# EAGLE design v1 (EAGLE 6.6.0)
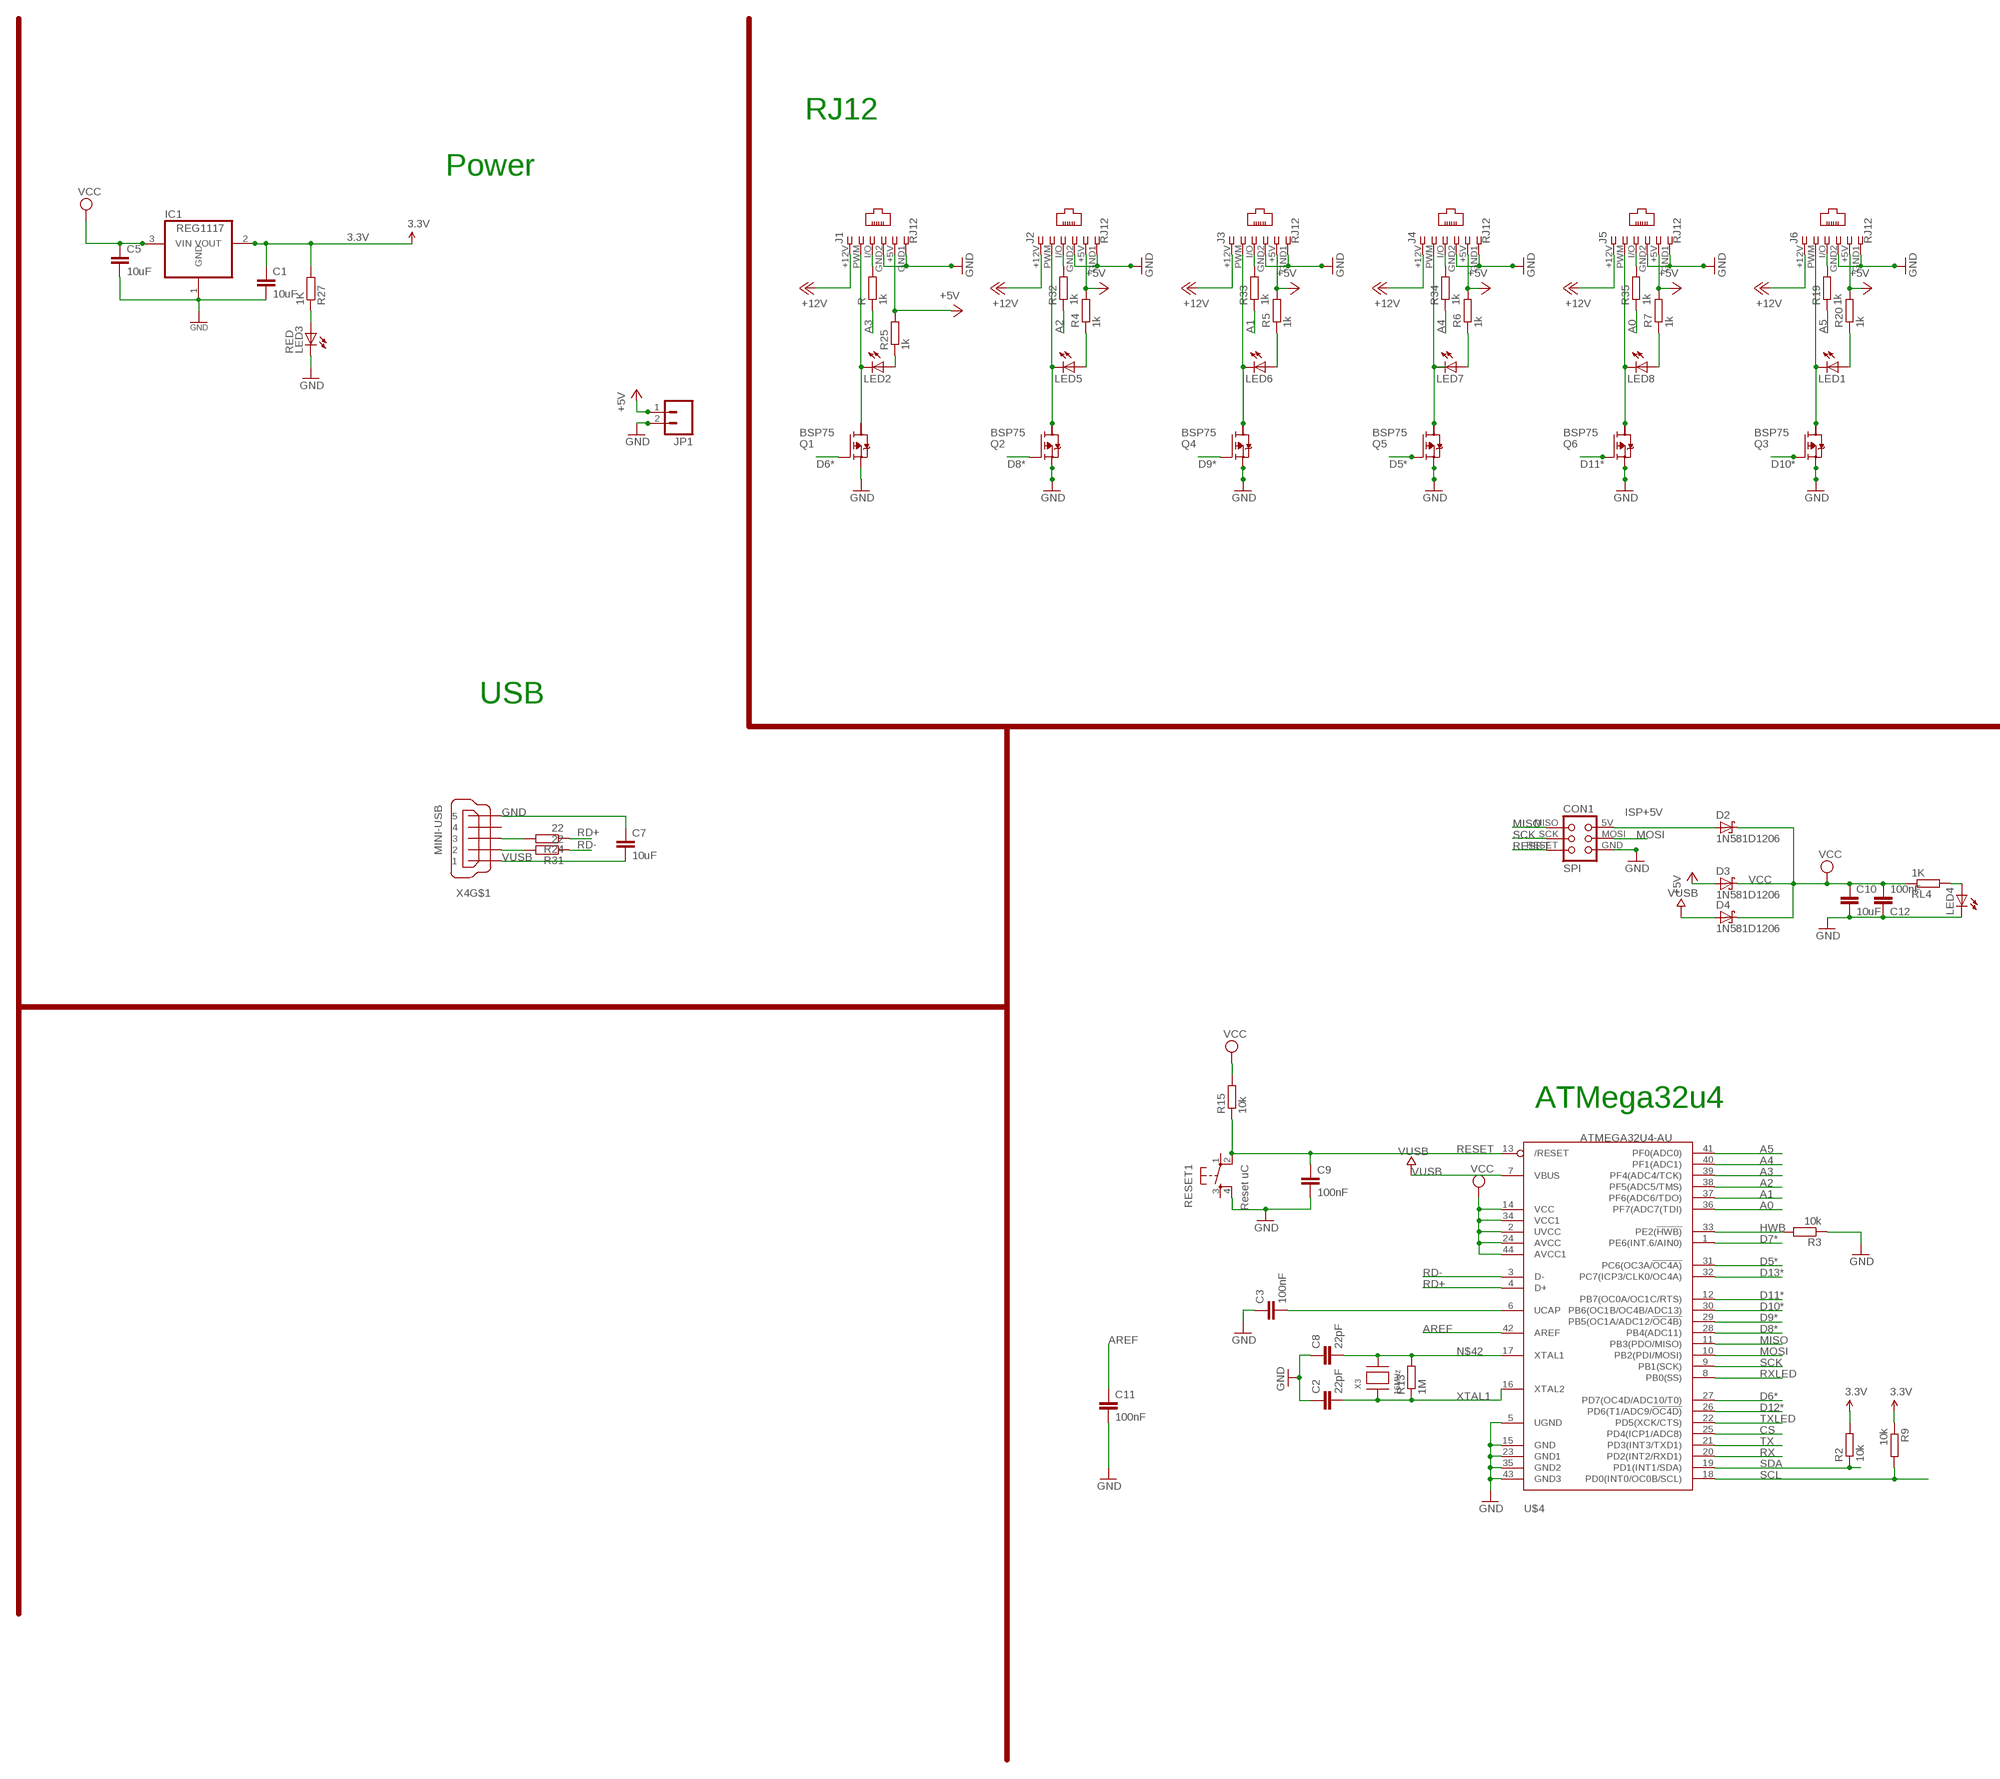
[diagram p0: schematic, sheet 1, part 1 of 2]
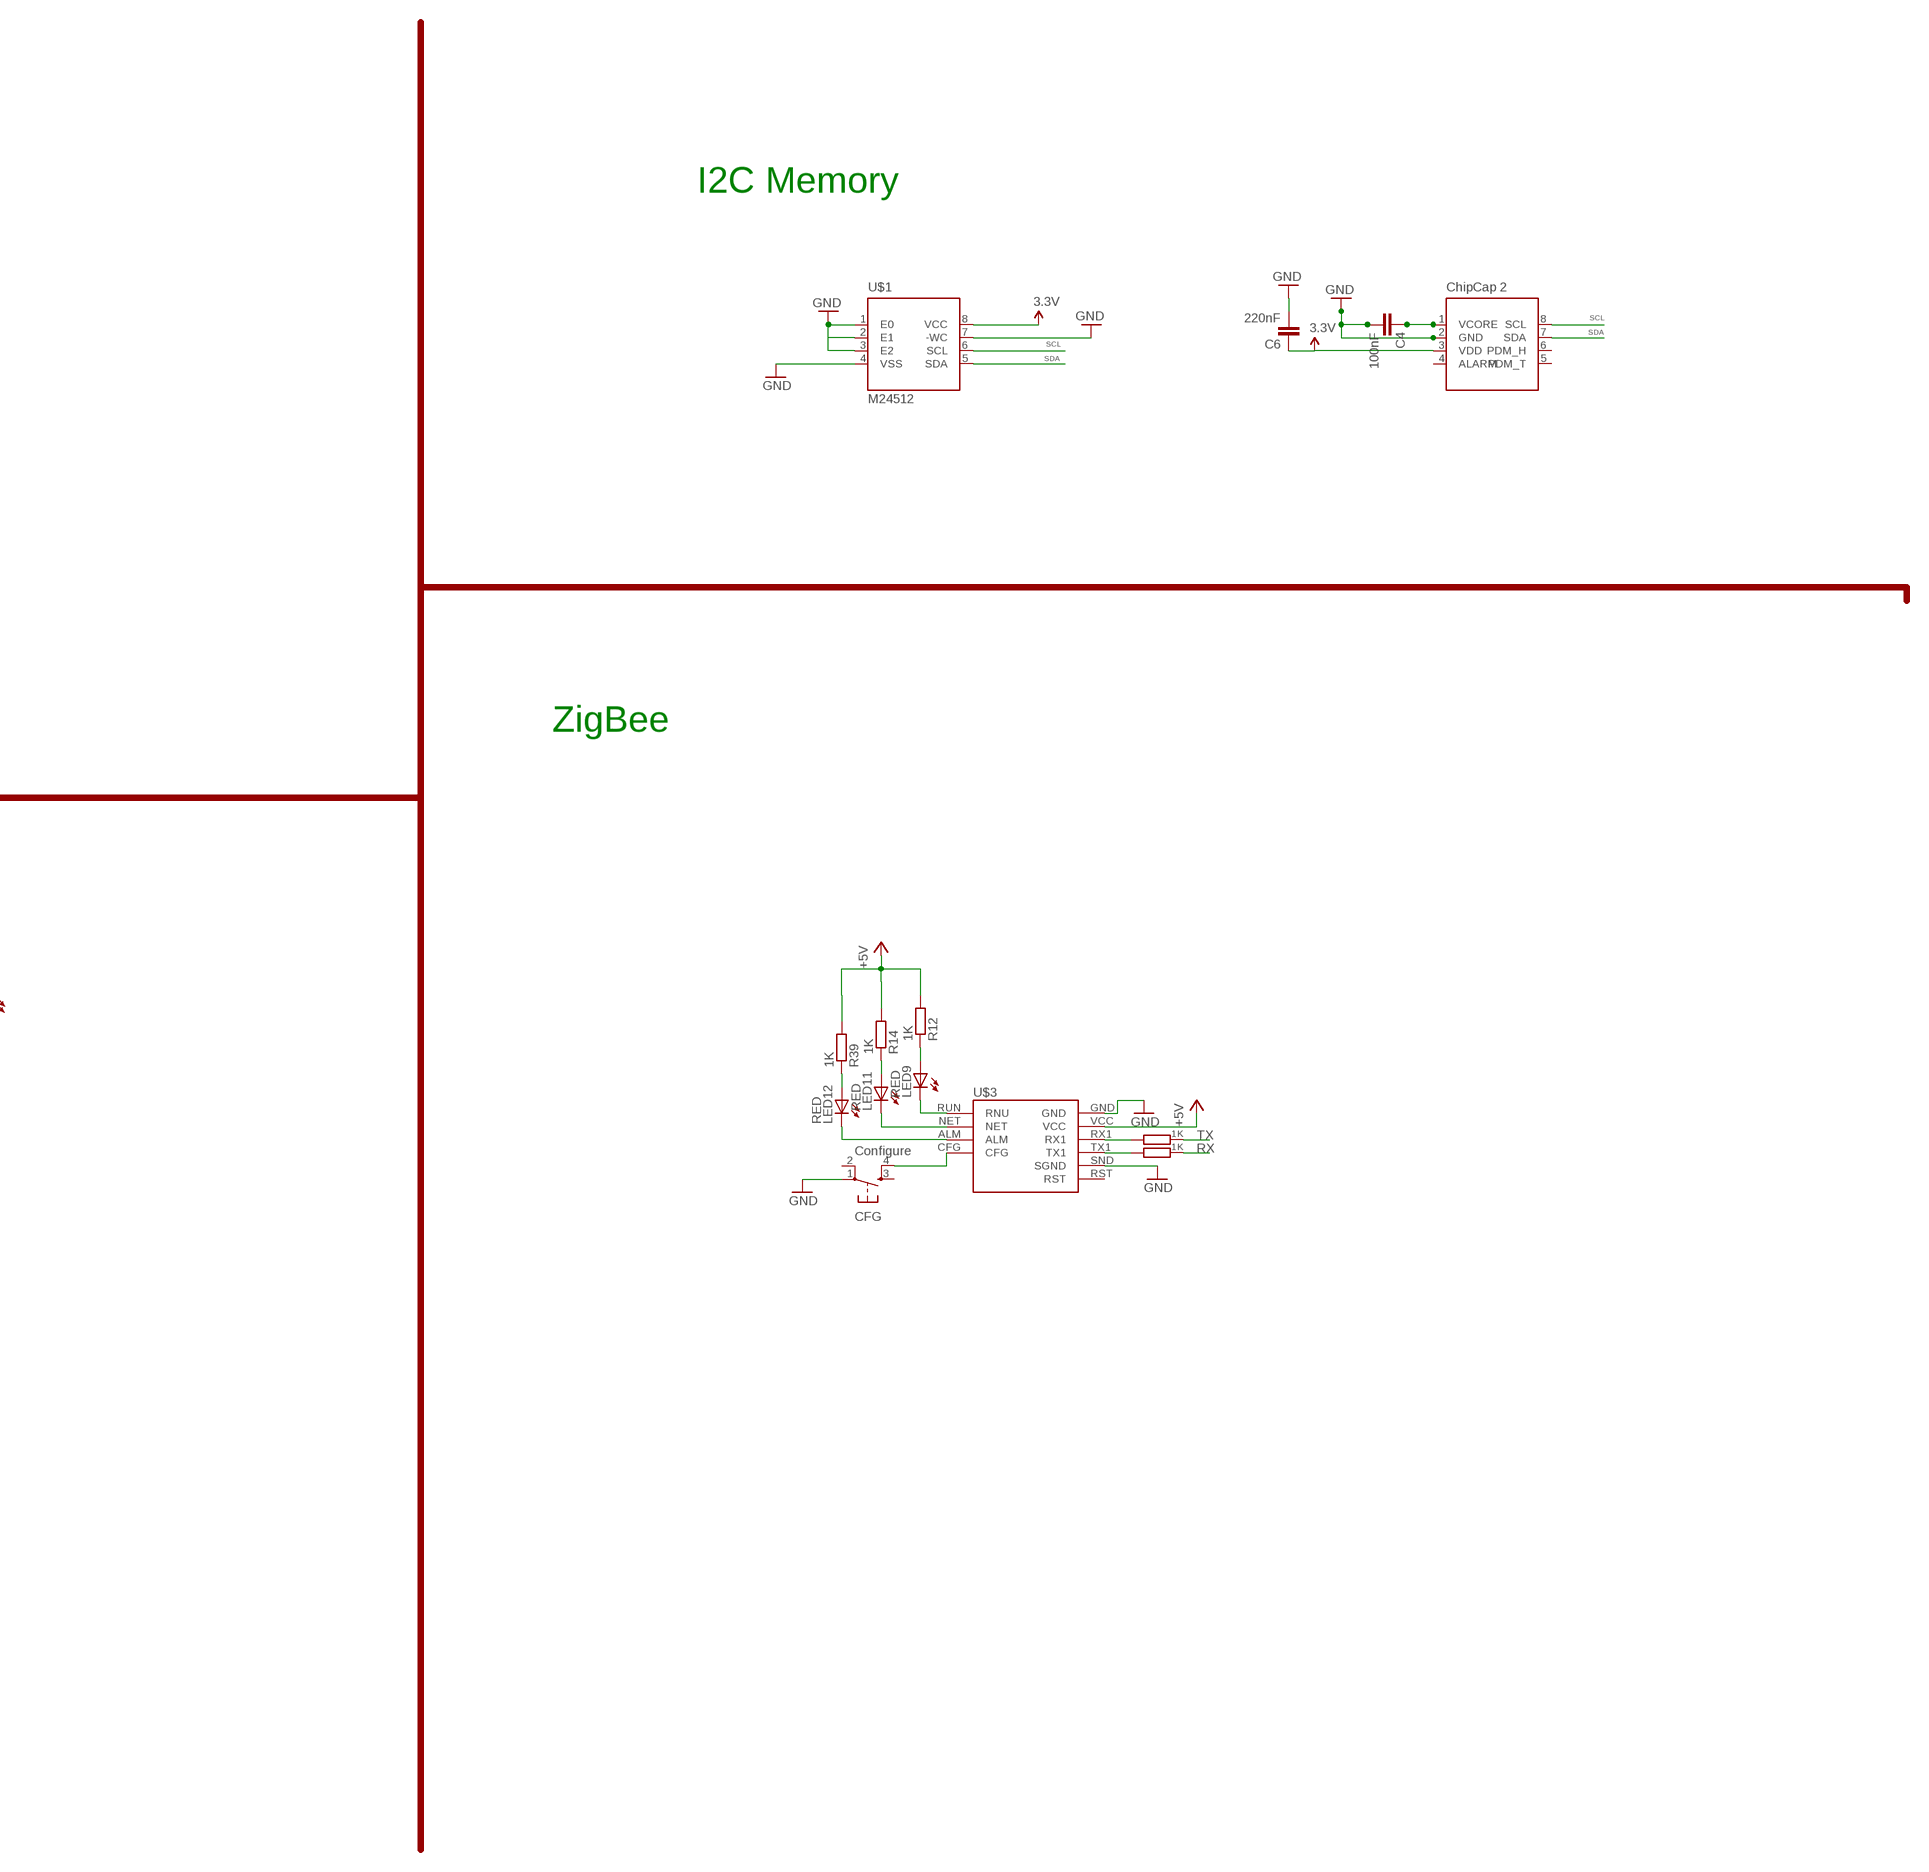
[diagram p1: schematic, sheet 1, part 2 of 2]

## Parts
C1  10uF  C-EUC1206  [C1206]
C2  22pF  C-EUC1206  [C1206]
C3  100nF  C-EUC1206  [C1206]
C4  100nF  C-EUC1206  [C1206]
C5  10uF  C-EUC1206  [C1206]
C6  220nF  C-EUC1206  [C1206]
C7  10uF  C-EUC1206  [C1206]
C8  22pF  C-EUC1206  [C1206]
C9  100nF  C-EUC1206  [C1206]
C10  10uF  C-EUC1206  [C1206]
C11  100nF  C-EUC1206  [C1206]
C12  100nF  C-EUC1206  [C1206]
CFG  Configure  TAC_SWITCHSMD  [TACTILE_SWITCH_SMD]
CON1  SPI  TINYISPT  [TC2030-MCP-NL]
D2  1N581D1206  [LED-1206]
D3  1N581D1206  [LED-1206]
D4  1N581D1206  [LED-1206]
IC1  REG1117  [SOT223]
J1  RJ12  RJ12STRAIGHT  [RJ12-STRAIGHT]
J2  RJ12  RJ12STRAIGHT  [RJ12-STRAIGHT]
J3  RJ12  RJ12STRAIGHT  [RJ12-STRAIGHT]
J4  RJ12  RJ12STRAIGHT  [RJ12-STRAIGHT]
J5  RJ12  RJ12STRAIGHT  [RJ12-STRAIGHT]
J6  RJ12  RJ12STRAIGHT  [RJ12-STRAIGHT]
JP1  M02LOCK_LONGPADS  [1X02_LOCK_LONGPADS]
LED1  Blue  LED3MM  [LED3MM]
LED2  Blue  LED3MM  [LED3MM]
LED3  RED  LEDCHIP-LED0805  [CHIP-LED0805]
LED4  RED  LED3MM  [LED3MM]
LED5  Blue  LED3MM  [LED3MM]
LED6  Blue  LED3MM  [LED3MM]
LED7  BLue  LED3MM  [LED3MM]
LED8  Blue  LED3MM  [LED3MM]
LED9  RED  LEDCHIP-LED0805  [CHIP-LED0805]
LED11  RED  LEDCHIP-LED0805  [CHIP-LED0805]
LED12  RED  LEDCHIP-LED0805  [CHIP-LED0805]
Q1  BSP75  BSP613P  [PG-SOT-223]
Q2  BSP75  BSP613P  [PG-SOT-223]
Q3  BSP75  BSP613P  [PG-SOT-223]
Q4  BSP75  BSP613P  [PG-SOT-223]
Q5  BSP75  BSP613P  [PG-SOT-223]
Q6  BSP75  BSP613P  [PG-SOT-223]
R  1k  R-EU_R0805  [R0805]
R2  10k  R-EU_M1206  [M1206]
R3  10k  R-EU_M0805  [M0805]
R4  1k  R-EU_R0805  [R0805]
R5  1k  R-EU_R0805  [R0805]
R6  1k  R-EU_R0805  [R0805]
R7  1k  R-EU_R0805  [R0805]
R8  1K  R-EU_R0805  [R0805]
R9  10k  R-EU_M1206  [M1206]
R11  1K  R-EU_R0805  [R0805]
R12  1K  R-EU_R0805  [R0805]
R13  1M  R-EU_R1206  [R1206]
R14  1K  R-EU_R0805  [R0805]
R15  10k  R-EU_M0805  [M0805]
R19  1k  R-EU_R0805  [R0805]
R20  1k  R-EU_R0805  [R0805]
R24  22  R-EU_M1206  [M1206]
R25  1k  R-EU_R0805  [R0805]
R27  1K  R-EU_R0805  [R0805]
R31  22  R-EU_M1206  [M1206]
R32  1k  R-EU_R0805  [R0805]
R33  1k  R-EU_R0805  [R0805]
R34  1k  R-EU_R0805  [R0805]
R35  1k  R-EU_R0805  [R0805]
R39  1K  R-EU_R0805  [R0805]
RESET1  Reset uC  TAC_SWITCHSMD  [TACTILE_SWITCH_SMD]
RL4  1K  R-EU_R0805  [R0805]
U$1  M24512  [SO8]
U$2  CHIPCAP  [CHIPCAP]
U$3  SZ05-ZIGBEESMD  [SZ05-ZIGBEE3]
U$4  ATMEGA32U4-AU  [TQFP44]
X3  16MHz  XTALNX6035  [NX6035]
X4  MINI-USB  MINI-USB-SCHIELD-32005-201  [32005-201]

## Nets
3.3V [power]: C1.1 C6.1 IC1.2(VOUT) R2.2 R9.1 R27.2 U$1.8(VCC) U$2.3(VDD)
+5V [power]: D3.A J1.+5V J2.+5V J3.+5V J4.+5V J5.+5V J6.+5V JP1.1 R4.2 R5.2 R6.2 R7.2 R12.2 R14.2 R20.2 R25.2 R39.2 U$3.VCC
+12V [power]: J1.+12V J2.+12V J3.+12V J4.+12V J5.+12V J6.+12V
A0: R35.1 U$4.36(PF7(ADC7(TDI))
A1: R33.1 U$4.37(PF6(ADC6/TDO))
A2: R32.1 U$4.38(PF5(ADC5/TMS))
A3: R.1 U$4.39(PF4(ADC4/TCK))
A4: R34.1 U$4.40(PF1(ADC1))
A5: R19.1 U$4.41(PF0(ADC0))
AREF: C11.1 U$4.42(AREF)
CS: U$4.25(PD4(ICP1/ADC8))
D5*: Q5.1(G) U$4.31(PC6(OC3A/!OC4A))
D6*: Q1.1(G) U$4.27(PD7(OC4D/ADC10/T0))
D7*: U$4.1(PE6(INT.6/AIN0))
D8*: Q2.1(G) U$4.28(PB4(ADC11))
D9*: Q4.1(G) U$4.29(PB5(OC1A/ADC12/!OC4B))
D10*: Q3.1(G) U$4.30(PB6(OC1B/OC4B/ADC13))
D11*: Q6.1(G) U$4.12(PB7(OC0A/OC1C/RTS))
D12*: U$4.26(PD6(T1/ADC9/!OC4D))
D13*: U$4.32(PC7(ICP3/CLK0/OC4A))
D+USB: R24.2 X4.3
D-USB: R31.2 X4.2
GND [power]: C1.2 C2.1 C3.1 C4.2 C5.2 C6.2 C7.1 C8.1 C9.2 C10.2 C11.2 C12.1 CFG.1 CON1.GND IC1.1(GND) J1.GND1 J1.GND2 J2.GND1 J2.GND2 J3.GND1 J3.GND2 J4.GND1 J4.GND2 J5.GND1 J5.GND2 J6.GND1 J6.GND2 JP1.2 LED3.C LED4.K(C) Q1.3(S) Q2.3(S) Q3.3(S) Q4.3(S) Q5.3(S) Q6.3(S) R3.1 RESET1.4 U$1.1(E0) U$1.2(E1) U$1.3(E2) U$1.4(VSS) U$1.7(-WC) U$2.2(GND) U$3.GND U$3.SND(SGND) U$4.5(UGND) U$4.15(GND) U$4.23(GND1) U$4.35(GND2) U$4.43(GND3) X4.5
GND1 [VIN]: LED9.C U$3.RUN(RNU)
GND2 [VIN]: LED11.C U$3.NET
GND3 [VIN]: LED12.C U$3.ALM
HWB: R3.2 U$4.33(PE2(!HWB))
ISP+5V: CON1.5V(VCC) D2.A
MISO: CON1.MISO U$4.11(PB3(PDO/MISO))
MOSI: CON1.MOSI U$4.10(PB2(PDI/MOSI))
N$1: J3.PWM LED6.K(C) Q4.2(D)
N$2: J2.I/O R32.2
N$3: J6.I/O R19.2
N$4: LED5.A R4.1
N$5: J4.PWM LED7.K(C) Q5.2(D)
N$6: C4.1 U$2.1(VCORE)
N$7: J3.I/O R33.2
N$9: LED1.A R20.1
N$11: R11.2 U$3.RX1
N$12: LED4.A RL4.2
N$16: C3.2 U$4.6(UCAP)
N$17: LED2.A R25.1
N$18: J1.I/O R.2
N$19: J5.PWM LED8.K(C) Q6.2(D)
N$20: LED3.A R27.1
N$21: J6.PWM LED1.K(C) Q3.2(D)
N$22: LED6.A R5.1
N$24: R8.2 U$3.TX1
N$25: LED9.A R12.1
N$26: LED11.A R14.1
N$27: LED12.A R39.1
N$28: J2.PWM LED5.K(C) Q2.2(D)
N$29: J4.I/O R34.2
N$30: LED7.A R6.1
N$32: J5.I/O R35.2
N$33: LED8.A R7.1
N$34: J1.PWM LED2.K(C) Q1.2(D)
N$35: CFG.4 U$3.CFG
N$42: C8.2 R13.2 U$4.17(XTAL1) X3.P$2
RD+: R24.1 U$4.4(D+)
RD-: R31.1 U$4.3(D-)
RESET: C9.1 CON1.RESET R15.1 RESET1.2 U$4.13(/RESET)
RX: R8.1 U$4.20(PD2(INT2/RXD1))
RXLED: U$4.8(PB0(SS))
SCK: CON1.SCK U$4.9(PB1(SCK))
SCL: R9.2 U$1.6(SCL) U$2.8(SCL) U$4.18(PD0(INT0/OC0B/SCL))
SDA: R2.1 U$1.5(SDA) U$2.7(SDA) U$4.19(PD1(INT1/SDA))
TX: R11.1 U$4.21(PD3(INT3/TXD1))
TXLED: U$4.22(PD5(XCK/CTS))
VCC [fine]: C5.1 C10.1 C12.2 D2.C D3.C D4.C IC1.3(VIN) R15.2 RL4.1 U$4.2(UVCC) U$4.14(VCC) U$4.24(AVCC) U$4.34(VCC1) U$4.44(AVCC1)
VUSB: C7.2 D4.A U$4.7(VBUS) X4.1
XTAL1: C2.2 R13.1 U$4.16(XTAL2) X3.P$1
Unconnected: CFG.2 CFG.3 Q1.4(D) Q2.4(D) Q3.4(D) Q4.4(D) Q5.4(D) Q6.4(D) RESET1.1 RESET1.3 U$2.4(ALARM) U$2.5(PDM_T) U$2.6(PDM_H) U$3.RST X4.4 X4.M1(S:S1) X4.M2(S:S2) X4.M3(S:S3) X4.M4(S:S4)

## Notes on the sheet
- RJ12
- Power
- I2C Memory
- ZigBee
- USB
- ATMega32u4

## Library data of the parts
C1-C12 = rcl:C-EU: CAPACITOR, European symbol
CFG RESET1 = lpatiny:TAC_SWITCH: Momentary Switch Button commonly used for reset or general input. Spark Fun Electronics SKU : COM-00097
CON1 = lpatiny:TINYISP: CONNECTOR
D2-D4 = lpatiny:1N581*: 1.0A SCHOTTKY BARRIER RECTIFIER Source: http://www.diodes.com/datasheets/ds23001.pdf
IC1 = burr-brown:REG1117: 800mA and 1A Low Dropout (LDO) Positive Regulator 1.8V, 2.5V, 2.85V, 3.3V, 5V, and Adj; MPN: REG1117; OC_FARNELL: 1097566; OC_NEWARK: 14P6981
J1-J6 = lpatiny:RJ12: CORCOM Modular RJ Jacks No Shield Source: www.tycoelectronics.com .. ENG_DS_1654001_1099_RJ_L_0507.pdf
JP1 = SparkFun:M02: Header 2 Standard 2-pin 0.1" header. Use with straight break away headers (SKU : PRT-00116), right angle break away headers (PRT-00553), swiss pins (PRT-00743), machine pins (PRT-00117), and female headers (PRT-00115). Molex polarized connector foot print use with SKU : PRT-08233 with associated crimp pins and housings.
LED1 LED2 LED4-LED8 = lpatiny:LED3MM
LED3 LED9 LED11 LED12 = adafruit:LED: LED OSRAM: - CHIPLED LG R971, LG N971, LY N971, LG Q971, LY Q971, LO R971, LY R971 LH N974, LH R974 LS Q976, LO Q976, LY Q976 LO Q996 - Hyper CHIPLED LW Q18S LB Q993, LB Q99A, LB R99A - SideLED LS A670, LO A670, LY A670, LG A670, LP A670 LB A673, LV A673, LT A673, LW A673 LH A674 LY A675 LS A676, LA A676, LO A676, LY A676, LW A676 LS A679, LY A679, LG A679 - Hyper Micro SIDELED® LS Y876, LA Y876, LO Y876, LY Y876 LT Y87S - SmartLED LW L88C, LW L88S LB L89C, LB L89S, LG L890 LS L89K, LO L89K, LY L89K LS L896, LA L896, LO L896, LY L896 - TOPLED LS T670, LO T670, LY T670, LG T670, LP T670 LSG T670, LSP T670, LSY T670, LOP T670, LYG T670 LG T671, LOG T671, LSG T671 LB T673, LV T673, LT T673, LW T673 LH T674 LS T676, LA T676, LO T676, LY T676, LB T676, LH T676, LSB T676, LW T676 LB T67C, LV T67C, LT T67C, LS T67K, LO T67K, LY T67K, LW E67C LS E67B, LA E67B, LO E67B, LY E67B, LB E67C, LV E67C, LT E67C LW T67C LS T679, LY T679, LG T679 LS T770, LO T770, LY T770, LG T770, LP T770 LB T773, LV T773, LT T773, LW T773 LH T774 LS E675, LA E675, LY E675, LS T675 LS T776, LA T776, LO T776, LY T776, LB T776 LHGB T686 LT T68C, LB T68C - Hyper Mini TOPLED® LB M676 - Mini TOPLED Santana® LG M470 LS M47K, LO M47K, LY M47K Source: http://www.osram.convergy.de/
Q1-Q6 = infineon:BSP613P: SIPMOS (R) Small-Signal-Transistor P-Channel (2 Drain) Source: http://www.infineon.com/dgdl/BSP613P_Rev2.4.pdf; OC_FARNELL: unknown; OC_NEWARK: unknown
R R4-R8 R11-R14 R19 R20 R25 R27 R32-R35 R39 = rcl:R-EU_: RESISTOR, European symbol
R2 R3 R9 R15 R24 R31 RL4 = resistor:R-EU_: RESISTOR, European symbol
U$1 = lpatiny:M24512
U$2 = lpatiny:CHIPCAP
U$3 = lpatiny:SZ05-ZIGBEE
U$4 = adafruit:ATMEGA32U4: http://www.ladyada.net/library/eagle
X3 = lpatiny:XTAL: Low cost SMT crystals, no capacitors included http://www.ladyada.net/library/eagle
X4 = con-cypressindustries:MINI-USB-SCHIELD-: MINI USB-B Conector Source: www.cypressindustries.com; OC_FARNELL: unknown; OC_NEWARK: unknown

## Net classes
0 default: width 0.305 mm
1 power: width 0.457 mm
2 VIN: width 0.457 mm
3 fine: width 0.305 mm
4 aref: width 0.305 mm

## Board
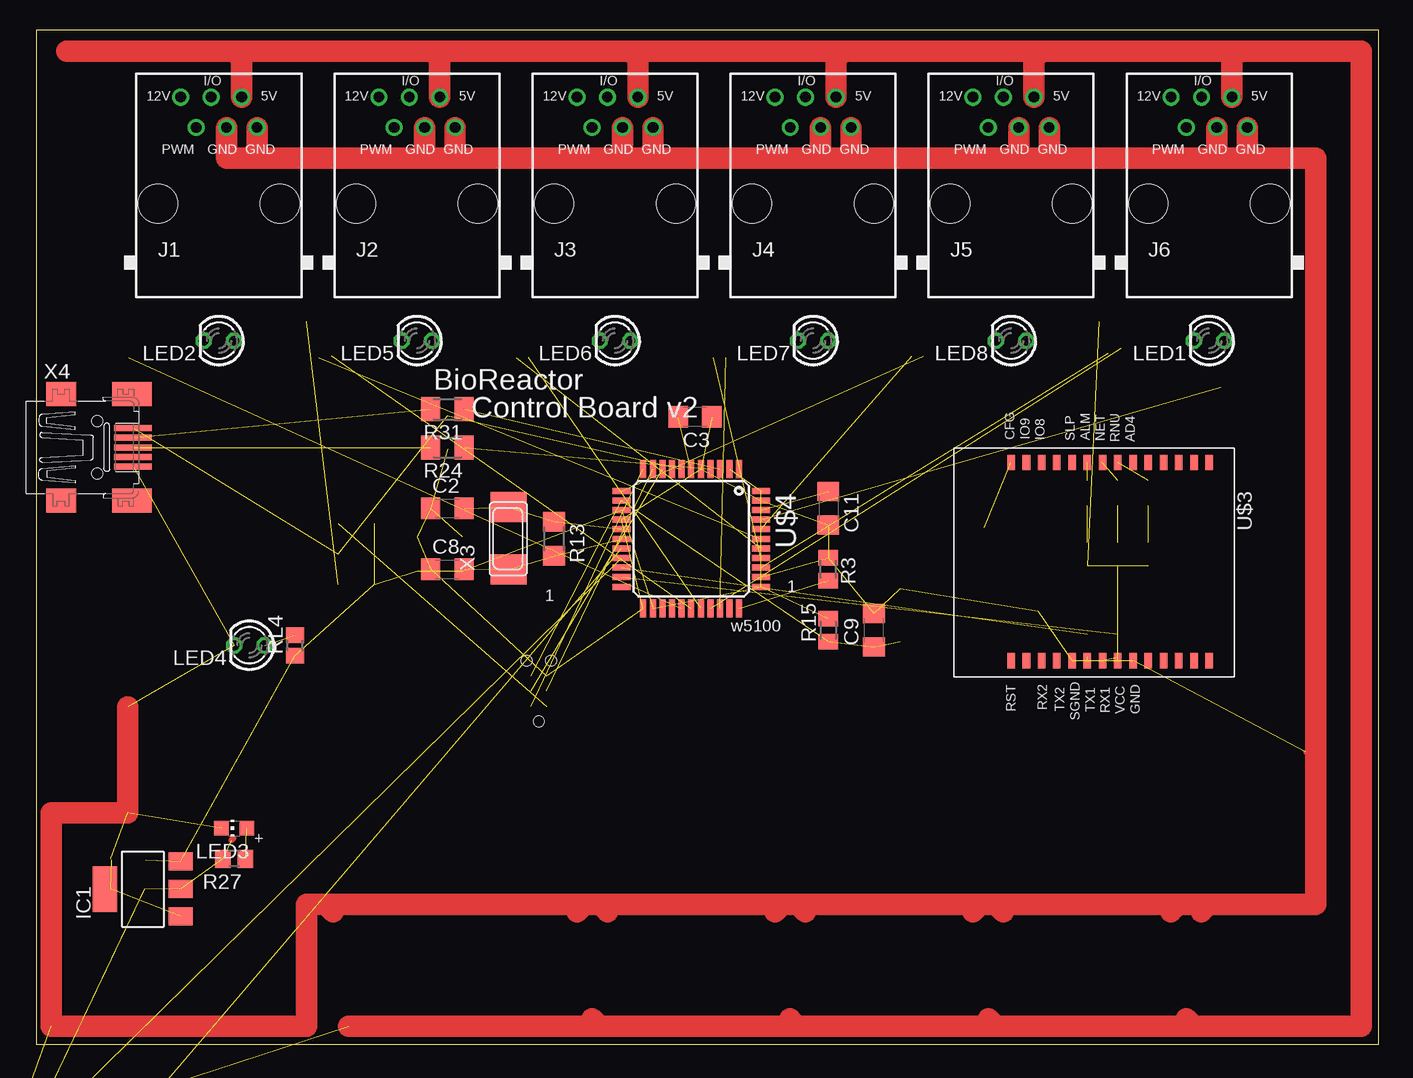
[diagram p2: board, top side]
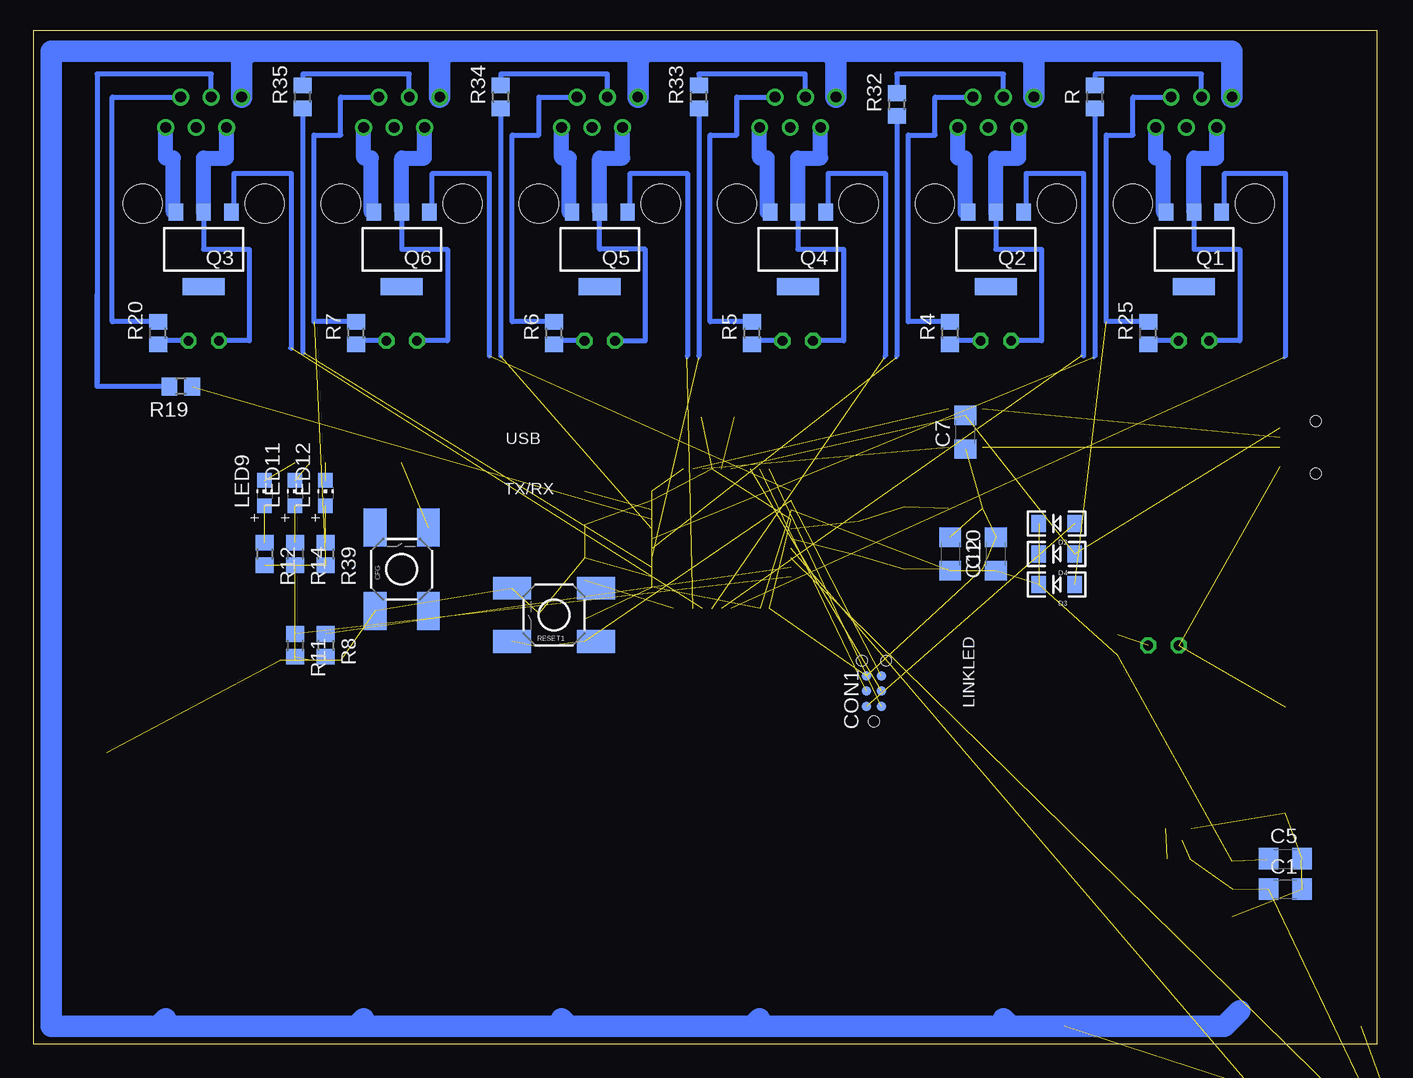
[diagram p3: board, bottom side, seen from below]

Size 111.94 x 84.57 mm. Coordinates in mm from the lower left corner, seen from the top.
Outline: 0,0 111.94,0 111.94,84.57 0,84.57 0,0
Copper layers (1*16): Top 0.035mm / dielectric 1.5mm / Bottom 0.035mm
Design rules "Fusion_eagle_rule_v1.1": minimum track width 6mil, minimum drill 12mil, track to track 6mil, track to pad 6mil, pad to pad 6mil, via to via 6mil, smd to smd 0mil, copper to edge 10mil, drill to drill 10mil, minimum pad ring 10mil, minimum via ring 6mil, stop-mask expansion 2mil, vias tented up to drill 100mil, thermal gap 10mil
bKeepout: area -1.3,57.4 to 114.3,85.3; area -7.6,54.9 to 108,82.8
tRestrict: area -6.3,58.7 to 116.8,85.3; area 22.9,-4.8 to 118.1,16.8
bRestrict: area -6.3,58.7 to 116.8,85.3; area 22.9,-4.8 to 118.1,16.8
vRestrict: area 47,34.5 to 62.2,38.4; area 47,35.8 to 50.8,49.8; area 58.4,37.1 to 62.2,49.8; area 47,46 to 62.2,49.8; area 47,25.7 to 62.2,29.5

### Footprints (pad centres in the part's own frame; a part is rotated, then mirrored left to right if it is on the bottom)
C1206 = smd 1.6 x 1.8: 1 -1.4,0; 2 1.4,0
TACTILE_SWITCH_SMD = smd 3.175 x 1.905: 1 -3.493,2.223; 2 3.493,2.223; 3 -3.493,-2.223; 4 3.493,-2.223
TC2030-MCP-NL = smd 0.787 x 0.787: 5V 1.27,0.635; GND 3.81,0.635; MISO 1.27,-0.635; MOSI 2.54,0.635; RESET 3.81,-0.635; SCK 2.54,-0.635 | hole 0.889: 0,0; 5.08,-1.016; 5.08,1.016
LED-1206 = smd 1.2 x 1.4: A -1.5,0; C 1.5,0
SOT223 = smd 1.499 x 2.007: 1 -2.261,-3.15; 2 0.025,-3.15; 3 2.311,-3.15 | smd 3.81 x 2.007: 4 0,3.15
RJ12-STRAIGHT = drill 0.9 pad 1.4: +5V 1.905,8.89; +12V -3.175,8.89; GND1 3.175,6.35; GND2 0.635,6.35; I/O -0.635,8.89; PWM -1.905,6.35 | hole 3.251: -5.08,0; 5.08,0
1X02_LOCK_LONGPADS = drill 1.016 long: 1 -0.127,0; 2 2.667,0
LED3MM = drill 0.813 octagon: A -1.27,0; K 1.27,0
CHIP-LED0805 = smd 1.2 x 1.2: A 0,-1.05; C 0,1.05
PG-SOT-223 = smd 1.2 x 1.4: 1 -2.311,-3.099; 2 0,-3.099; 3 2.311,-3.099 | smd 3.5 x 1.4: 4 0,3.099
R0805 = smd 1.3 x 1.5: 1 -0.95,0; 2 0.95,0
M1206 = smd 1.6 x 2: 1 -1.4,0; 2 1.4,0
M0805 = smd 1.3 x 1.6: 1 -0.95,0; 2 0.95,0
R1206 = smd 1.6 x 1.803: 1 -1.422,0; 2 1.422,0
R0805' = smd 1.3 x 1.5: 1 -0.85,0; 2 0.85,0
SO8 = smd 0.66 x 2.032: 1 -3.81,-3.073; 2 -2.54,-3.073; 3 -1.27,-3.073; 4 0,-3.073; 5 0,3.073; 6 -1.27,3.073; 7 -2.54,3.073; 8 -3.81,3.073
CHIPCAP = smd 0.66 x 2.032: 1 -2.54,-3.073; 2 -1.27,-3.073; 3 0,-3.073; 4 1.27,-3.073; 5 1.27,2.438; 6 0,2.438; 7 -1.27,2.438; 8 -2.54,2.438
SZ05-ZIGBEE3 = smd 1.27 x 0.635: AD1 -7.62,6.35; AD2 -7.62,5.08; AD3 -7.62,3.81; AD4 -7.62,2.54; ALM -7.62,-1.27; C485 -7.62,-3.81; CFG -7.62,-7.62; GND 8.89,2.54; IO1 -7.62,8.89; IO2 -7.62,7.62; IO3 8.89,8.89; IO4 8.89,7.62; IO5 8.89,6.35; IO6 8.89,5.08; IO7 8.89,3.81; IO8 -7.62,-5.08; IO9 -7.62,-6.35; MS 8.89,-6.35; NET -7.62,0; RST 8.89,-7.62; RUN -7.62,1.27; RX1 8.89,0; RX2 8.89,-5.08; SLD -7.62,-2.54; SND 8.89,-2.54; TX1 8.89,-1.27; TX2 8.89,-3.81; VCC 8.89,1.27
TQFP44 = smd 1.5 x 0.5: 1 -5.8,4; 2 -5.8,3.2; 3 -5.8,2.4; 4 -5.8,1.6; 5 -5.8,0.8; 6 -5.8,0; 7 -5.8,-0.8; 8 -5.8,-1.6; 9 -5.8,-2.4; 10 -5.8,-3.2; 11 -5.8,-4; 23 5.8,-4; 24 5.8,-3.2; 25 5.8,-2.4; 26 5.8,-1.6; 27 5.8,-0.8; 28 5.8,0; 29 5.8,0.8; 30 5.8,1.6; 31 5.8,2.4; 32 5.8,3.2; 33 5.8,4 | smd 0.5 x 1.5: 12 -4,-5.8; 13 -3.2,-5.8; 14 -2.4,-5.8; 15 -1.6,-5.8; 16 -0.8,-5.8; 17 0,-5.8; 18 0.8,-5.8; 19 1.6,-5.8; 20 2.4,-5.8; 21 3.2,-5.8; 22 4,-5.8; 34 4,5.8; 35 3.2,5.8; 36 2.4,5.8; 37 1.6,5.8; 38 0.8,5.8; 39 0,5.8; 40 -0.8,5.8; 41 -1.6,5.8; 42 -2.4,5.8; 43 -3.2,5.8; 44 -4,5.8
NX6035 = smd 2.5 x 3: P$1 2.665,0; P$2 -2.565,0
32005-201 = smd 3.1 x 0.5: 1 3,1.6; 2 3,0.8; 3 3,0; 4 3,-0.8; 5 3,-1.6 | smd 2.5 x 2: M1 -3,-4.45; M2 -3,4.45 | smd 3.3 x 2: M3 2.9,4.45; M4 2.9,-4.45 | hole 0.9: 0,2.2; 0,-2.2

### Placement (x,y rotation side)
C1  7.62,12.95 0 bottom
C2  34.29,44.7 0 top
C3  54.93,52.32 180 top
C4  -10.16,-35.31 0 top  (outside the outline)
C5  7.62,15.49 0 bottom
C6  -10.16,-41.66 0 top  (outside the outline)
C7  34.29,51.05 90 bottom
C8  34.29,39.62 0 top
C9  69.85,34.54 90 top
C10  31.75,40.89 90 bottom
C11  66.04,44.7 270 top
C12  35.56,40.89 270 bottom
CFG  81.28,39.62 90 bottom
CON1  41.91,26.92 90 bottom
D2  26.67,43.43 180 bottom
D3  26.67,38.35 180 bottom
D4  26.67,40.89 180 bottom
IC1  8.89,12.95 90 top
J1  15.24,70.1 0 top
J2  31.75,70.1 0 top
J3  48.26,70.1 0 top
J4  64.77,70.1 0 top
J5  81.28,70.1 0 top
J6  97.79,70.1 0 top
JP1  -5.08,-8.64 0 top  (outside the outline)
LED1  97.79,58.67 180 top
LED2  15.24,58.67 180 top
LED3  16.51,18.03 90 top
LED4  17.78,33.27 180 top
LED5  31.75,58.67 180 top
LED6  48.26,58.67 180 top
LED7  64.77,58.67 180 top
LED8  81.28,58.67 180 top
LED9  92.71,45.97 0 bottom
LED11  90.17,45.97 0 bottom
LED12  87.63,45.97 0 bottom
Q1  15.24,66.29 180 bottom
Q2  31.75,66.29 180 bottom
Q3  97.79,66.29 180 bottom
Q4  48.26,66.29 180 bottom
Q5  64.77,66.29 180 bottom
Q6  81.28,66.29 180 bottom
R  23.5,78.99 90 bottom
R2  -5.08,-13.72 0 top  (outside the outline)
R3  66.04,39.62 270 top
R4  35.56,59.31 90 bottom
R5  52.07,59.31 90 bottom
R6  68.58,59.31 90 bottom
R7  85.09,59.31 90 bottom
R8  87.63,33.27 270 bottom
R9  -5.08,-20.07 0 top  (outside the outline)
R11  90.17,33.27 270 bottom
R12  92.71,40.89 270 bottom
R13  43.18,42.16 270 top
R14  90.17,40.89 270 bottom
R15  66.04,34.54 90 top
R19  99.69,54.86 180 bottom
R20  101.6,59.31 90 bottom
R24  34.29,49.78 180 top
R25  19.05,59.31 90 bottom
R27  16.51,15.49 180 top
R31  34.29,52.96 180 top
R32  40.01,78.36 90 bottom
R33  56.52,78.99 90 bottom
R34  73.03,78.99 90 bottom
R35  89.53,78.99 90 bottom
R39  87.63,40.89 270 bottom
RESET1  68.58,35.81 180 bottom
RL4  1K  [R0805']  21.59,33.27 90 top
U$1  0,-27.69 0 top  (outside the outline)
U$2  -10.16,-27.69 0 top  (outside the outline)
U$3  88.9,40.89 270 top
U$4  54.61,42.16 270 top
X3  39.37,42.16 90 top
X4  5.08,49.78 0 top

### Tracks (layer width: path | path; a pad name or v marks a point on that pad's centre or on a via)
3.3V  (8 unrouted)
  Top 0.457: 16.46,17.22 16.26,17.02
+5V  (6 unrouted)
  Top 1.778: 2.54,82.8 16.51,82.8 | 16.51,82.8 33.02,82.8 | 33.02,82.8 49.53,82.8 | 49.53,82.8 67.31,82.8 | 67.31,82.8 83.82,82.8 | 83.82,82.8 100.33,82.8 | 100.33,82.8 110.49,82.8 110.49,1.52 96.52,1.52 | 96.52,1.52 80.01,1.52 | 80.01,1.52 63.5,1.52 | 63.5,1.52 46.99,1.52 | 46.99,1.52 26.04,1.52 | J1.+5V 17.14,82.17 16.51,82.8 | J2.+5V 33.66,82.17 33.02,82.8 | J3.+5V 50.16,82.17 49.53,82.8 | J4.+5V 66.67,82.17 67.31,82.8 | J5.+5V 83.19,82.17 83.82,82.8 | J6.+5V 99.69,82.17 100.33,82.8 | 46.35,2.16 46.99,1.52 | 62.87,2.16 63.5,1.52 | 79.38,2.16 80.01,1.52 | 95.89,2.16 96.52,1.52
  Bottom 0.406: R25.2 22.54,60.26 22.54,75.82 20.32,75.82 20.32,78.99 J1.+5V | R4.2 39.05,60.26 39.05,75.82 36.83,75.82 36.83,78.99 J2.+5V | R5.2 55.56,60.26 55.56,75.82 53.34,75.82 53.34,78.99 J3.+5V | R6.2 72.07,60.26 72.07,75.82 69.85,75.82 69.85,78.99 J4.+5V | R7.2 88.58,60.26 88.58,75.82 86.36,75.82 86.36,78.99 J5.+5V | R20.2 105.41,60.26 105.41,78.99 J6.+5V
+12V
  Bottom 1.778: 11.43,2.79 12.7,1.52 30.48,1.52 | 30.48,1.52 52.07,1.52 | 52.07,1.52 67.31,1.52 | 67.31,1.52 85.09,1.52 | 85.09,1.52 101.6,1.52 | 101.6,1.52 110.49,1.52 110.49,82.8 93.98,82.8 | 93.98,82.8 77.47,82.8 | 77.47,82.8 60.96,82.8 | 60.96,82.8 45.72,82.8 | 45.72,82.8 29.21,82.8 | 29.21,82.8 12.06,82.8 J1.+12V | J3.+12V 45.09,82.17 45.72,82.8 | J4.+12V 61.59,82.17 60.96,82.8 | J5.+12V 78.11,82.17 77.47,82.8 | J6.+12V 94.61,82.17 93.98,82.8 | J2.+12V 28.57,82.17 29.21,82.8 | 100.97,2.16 101.6,1.52 | 84.45,2.16 85.09,1.52 | 67.94,2.16 67.31,1.52 | 51.44,2.16 52.07,1.52 | 31.11,2.16 30.48,1.52
A0  (1 unrouted)
  Bottom 0.305: 89.41,57.66 89.53,57.72
  Bottom 0.406: R35.1 89.53,57.72
A1  (1 unrouted)
  Bottom 0.305: 56.49,57.25 56.52,57.4
  Bottom 0.406: R33.1 56.52,57.4
A2  (1 unrouted)
  Bottom 0.305: 40.03,57.25 40.01,57.4
  Bottom 0.406: R32.1 40.01,57.4
A3  (1 unrouted)
  Bottom 0.305: 23.57,57.25 23.5,57.4
  Bottom 0.406: R.1 23.5,57.4
A4  (1 unrouted)
  Bottom 0.305: 72.95,57.45 73.03,57.45
  Bottom 0.406: R34.1 73.03,57.45 73.03,57.4
A5  (1 unrouted)
  Bottom 0.305: 98.96,54.81 98.75,54.81 R19.1
AREF  (1 unrouted)
D5*  (1 unrouted)
  Bottom 0.305: 57.51,57.25 57.47,57.4
  Bottom 0.406: Q5.1 62.23,69.39 62.23,72.64 57.47,72.64 57.47,57.4
D6*  (1 unrouted)
  Bottom 0.305: 7.72,57.25 7.62,57.4
  Bottom 0.406: Q1.1 12.7,69.39 12.7,72.64 7.62,72.64 7.62,57.4
D8*  (1 unrouted)
  Bottom 0.305: 24.59,57.45 24.45,57.45
  Bottom 0.406: Q2.1 29.21,69.39 29.21,72.64 24.45,72.64 24.45,57.45 24.45,57.4
D9*  (1 unrouted)
  Bottom 0.305: 41.05,57.25 40.96,57.4
  Bottom 0.406: Q4.1 45.72,69.39 45.72,72.64 40.96,72.64 40.96,57.4
D10*  (1 unrouted)
  Bottom 0.305: 90.63,58.06 90.49,58.06
  Bottom 0.406: Q3.1 95.25,69.39 95.25,72.64 90.49,72.64 90.49,58.06 90.49,58.04
D11*  (1 unrouted)
  Bottom 0.305: 73.97,58.06 73.98,58.06
  Bottom 0.406: Q6.1 78.74,69.39 78.74,72.64 73.98,72.64 73.98,58.06 73.98,57.4
D+USB  (1 unrouted)
D-USB  (1 unrouted)
GND  (34 unrouted)
  Top 0.457: 15.85,18.24 15.65,18.03 LED3.C | 105.87,24.33 106.68,24.33
  Top 1.778: 24.13,11.68 22.54,11.68 22.54,1.52 1.27,1.52 1.27,19.3 7.62,19.3 7.62,28.15 | 24.13,11.68 45.72,11.68 | 45.72,11.68 46.99,11.68 | 46.99,11.68 62.23,11.68 | 62.23,11.68 63.5,11.68 | 63.5,11.68 78.74,11.68 | 78.74,11.68 80.01,11.68 | 80.01,11.68 95.25,11.68 | 95.25,11.68 97.79,11.68 | 97.79,11.68 106.68,11.68 106.68,24.33 106.68,73.91 100.33,73.91 | 100.33,73.91 99.06,73.91 | 99.06,73.91 85.09,73.91 | 85.09,73.91 81.28,73.91 | 81.28,73.91 68.58,73.91 | 68.58,73.91 64.77,73.91 | 64.77,73.91 50.8,73.91 | 50.8,73.91 48.26,73.91 | 48.26,73.91 35.56,73.91 | 35.56,73.91 31.75,73.91 | 31.75,73.91 17.78,73.91 | 17.78,73.91 15.88,73.91 J1.GND2 | J1.GND1 18.41,74.55 17.78,73.91 | J2.GND2 32.38,74.55 31.75,73.91 | J2.GND1 34.92,74.55 35.56,73.91 | J3.GND2 48.9,74.55 48.26,73.91 | J3.GND1 51.44,74.55 50.8,73.91 | J4.GND2 65.41,74.55 64.77,73.91 | J4.GND1 67.94,74.55 68.58,73.91 | J5.GND2 81.92,74.55 81.28,73.91 | J5.GND1 84.45,74.55 85.09,73.91 | J6.GND2 98.42,74.55 99.06,73.91 | J6.GND1 100.97,74.55 100.33,73.91 | 24.77,11.05 24.13,11.68 | 45.09,11.05 45.72,11.68 | 47.62,11.05 46.99,11.68 | 61.59,11.05 62.23,11.68 | 64.14,11.05 63.5,11.68 | 78.11,11.05 78.74,11.68 | 80.64,11.05 80.01,11.68 | 94.61,11.05 95.25,11.68 | 97.16,11.05 97.79,11.68
  Bottom 0.457: 6.3,12.95 C1.2 | 6.3,15.39 C5.2 6.5,15.39
  Bottom 1.27: Q2.3 34.29,69.39 34.29,73.91 34.92,73.91 J2.GND1 | Q4.3 50.8,69.39 50.8,73.91 51.44,73.91 J3.GND1 | Q5.3 67.31,69.39 67.31,73.91 67.94,73.91 J4.GND1 | Q6.3 83.82,69.39 83.82,73.91 84.45,73.91 J5.GND1 | Q3.3 100.33,69.39 100.33,73.91 100.97,73.91 J6.GND1 | Q1.3 17.78,69.39 17.78,73.91 18.41,73.91 J1.GND1
GND1  (1 unrouted)
GND2  (1 unrouted)
GND3  (1 unrouted)
HWB  (1 unrouted)
ISP+5V  (1 unrouted)
MISO  (1 unrouted)
MOSI  (1 unrouted)
N$1
  Bottom 0.406: Q4.2 48.26,66.29 44.45,66.29 44.45,58.67 LED6.K
  Bottom 1.27: Q4.2 48.26,73.91 46.35,73.91 J3.PWM
N$2
  Bottom 0.406: J2.I/O 31.11,80.9 40.01,80.9 R32.2
N$3
  Bottom 0.406: J6.I/O 97.16,80.9 106.68,80.9 106.68,62.48 | 106.68,62.48 106.68,56.13 | 106.68,56.13 106.68,55.18 | 106.68,55.18 106.68,56.13 | 106.68,56.13 106.68,62.48 | 106.68,55.18 106.68,56.13 | 106.68,56.13 106.68,62.48 | R19.2 106.68,54.86 106.68,56.13
N$4
  Bottom 0.406: LED5.A 35.56,58.67 R4.1
N$5
  Bottom 0.406: LED7.K 60.96,58.67 60.96,66.29 64.77,66.29 Q5.2
  Bottom 1.27: Q5.2 64.77,73.91 62.87,73.91 J4.PWM
N$6  (1 unrouted)
N$7
  Bottom 0.406: J3.I/O 47.62,80.9 56.52,80.9 R33.2
N$9
  Bottom 0.406: LED1.A 101.6,58.67 R20.1
N$11  (1 unrouted)
N$12  (1 unrouted)
N$16  (1 unrouted)
N$17
  Bottom 0.406: LED2.A 19.05,58.67 R25.1
N$18
  Bottom 0.406: J1.I/O 14.61,80.9 23.5,80.9 R.2
N$19
  Bottom 0.406: Q6.2 81.28,66.29 77.47,66.29 77.47,58.67 LED8.K
  Bottom 1.27: Q6.2 81.28,73.91 79.38,73.91 J5.PWM
N$20  (1 unrouted)
  Top 0.305: 17.48,18.03 LED3.A
N$21
  Bottom 0.406: Q3.2 97.79,66.29 93.98,66.29 93.98,58.67 LED1.K
  Bottom 1.27: Q3.2 97.79,73.91 95.89,73.91 J6.PWM
N$22
  Bottom 0.406: LED6.A 52.07,58.67 R5.1
N$24  (1 unrouted)
N$25  (1 unrouted)
N$26  (1 unrouted)
N$27  (1 unrouted)
N$28
  Bottom 0.406: Q2.2 31.75,66.29 27.94,66.29 27.94,58.67 LED5.K
  Bottom 1.27: Q2.2 31.75,73.91 29.84,73.91 J2.PWM
N$29
  Bottom 0.406: J4.I/O 64.14,80.9 73.03,80.9 R34.2
N$30
  Bottom 0.406: LED7.A 68.58,58.67 R6.1
N$32
  Bottom 0.406: J5.I/O 80.64,80.9 89.53,80.9 R35.2
N$33
  Bottom 0.406: LED8.A 85.09,58.67 R7.1
N$34
  Bottom 0.406: Q1.2 15.24,66.29 11.43,66.29 11.43,58.67 LED2.K
  Bottom 1.27: Q1.2 15.24,73.91 13.34,73.91 J1.PWM
N$35  (1 unrouted)
N$42  (3 unrouted)
RD+  (1 unrouted)
RD-  (1 unrouted)
RESET  (4 unrouted)
RX  (1 unrouted)
SCK  (1 unrouted)
SCL  (3 unrouted)
SDA  (3 unrouted)
TX  (1 unrouted)
VCC  (13 unrouted)
  Bottom 0.305: 9.14,15.39 C5.1 8.94,15.39
VUSB  (3 unrouted)
XTAL1  (3 unrouted)

### Text on the board
tNames: BioReactor | Control Board v2 | 1 | 1 | w5100
bNames: USB | TX/RX | LINKLED
203bmp: C:/Users/G/Pictures/logo_epfl.bmp